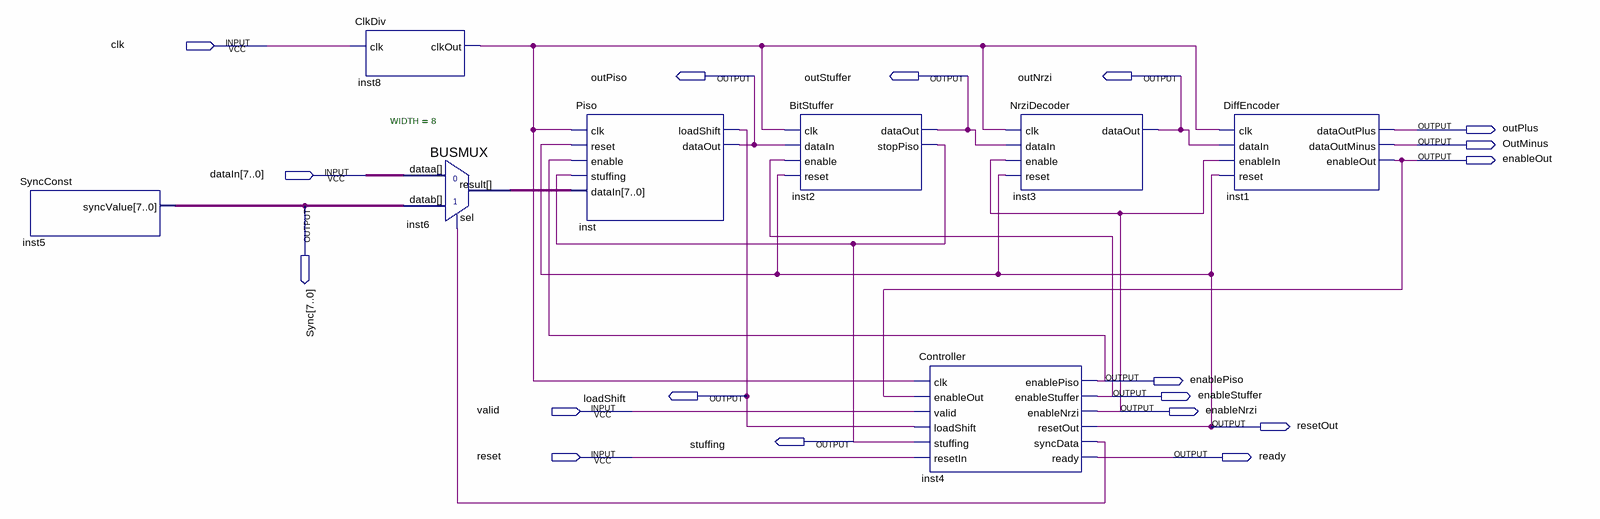
[diagram p0: schematic sheet]
// Quartus schematic CompleteTransmitter.bdf as structural Verilog: 8 symbols, 18 pins
module CompleteTransmitter (
  input  clk,
  input  [7:0] dataIn,
  input  valid,
  input  reset,
  output outPiso,
  output outStuffer,
  output outNrzi,
  output outPlus,
  output OutMinus,
  output enableOut,
  output [7:0] Sync,
  output enablePiso,
  output loadShift,
  output enableStuffer,
  output enableNrzi,
  output resetOut,
  output stuffing,
  output ready
);

  wire inst4_syncdata, inst8_clkout;
  wire [7:0] inst6_result;

  SyncConst inst5 (.syncValue(Sync));
  ClkDiv inst8 (.clk(clk), .clkOut(inst8_clkout));
  BUSMUX #(.WIDTH(8)) inst6 (.datab(Sync), .sel(inst4_syncdata), .dataa(dataIn), .result(inst6_result));
  Piso inst (
    .clk(inst8_clkout), .reset(resetOut), .enable(enablePiso), .stuffing(stuffing), .dataIn(inst6_result),
    .loadShift(loadShift), .dataOut(outPiso));
  BitStuffer inst2 (
    .clk(inst8_clkout), .dataIn(outPiso), .enable(enableStuffer), .reset(resetOut), .dataOut(outStuffer),
    .stopPiso(stuffing));
  Controller inst4 (
    .clk(inst8_clkout), .enableOut(enableOut), .valid(valid), .loadShift(loadShift), .stuffing(stuffing),
    .resetIn(reset), .enablePiso(enablePiso), .enableStuffer(enableStuffer), .enableNrzi(enableNrzi),
    .resetOut(resetOut), .syncData(inst4_syncdata), .ready(ready));
  NrziDecoder inst3 (.clk(inst8_clkout), .dataIn(outStuffer), .enable(enableNrzi), .reset(resetOut), .dataOut(outNrzi));
  DiffEncoder inst1 (
    .clk(inst8_clkout), .dataIn(outNrzi), .enableIn(enableNrzi), .reset(resetOut), .dataOutPlus(outPlus),
    .dataOutMinus(OutMinus), .enableOut(enableOut));
endmodule
